# EAGLE schematic A20-Watermelon_Rev_A (EAGLE 4.16), part 1 of 2
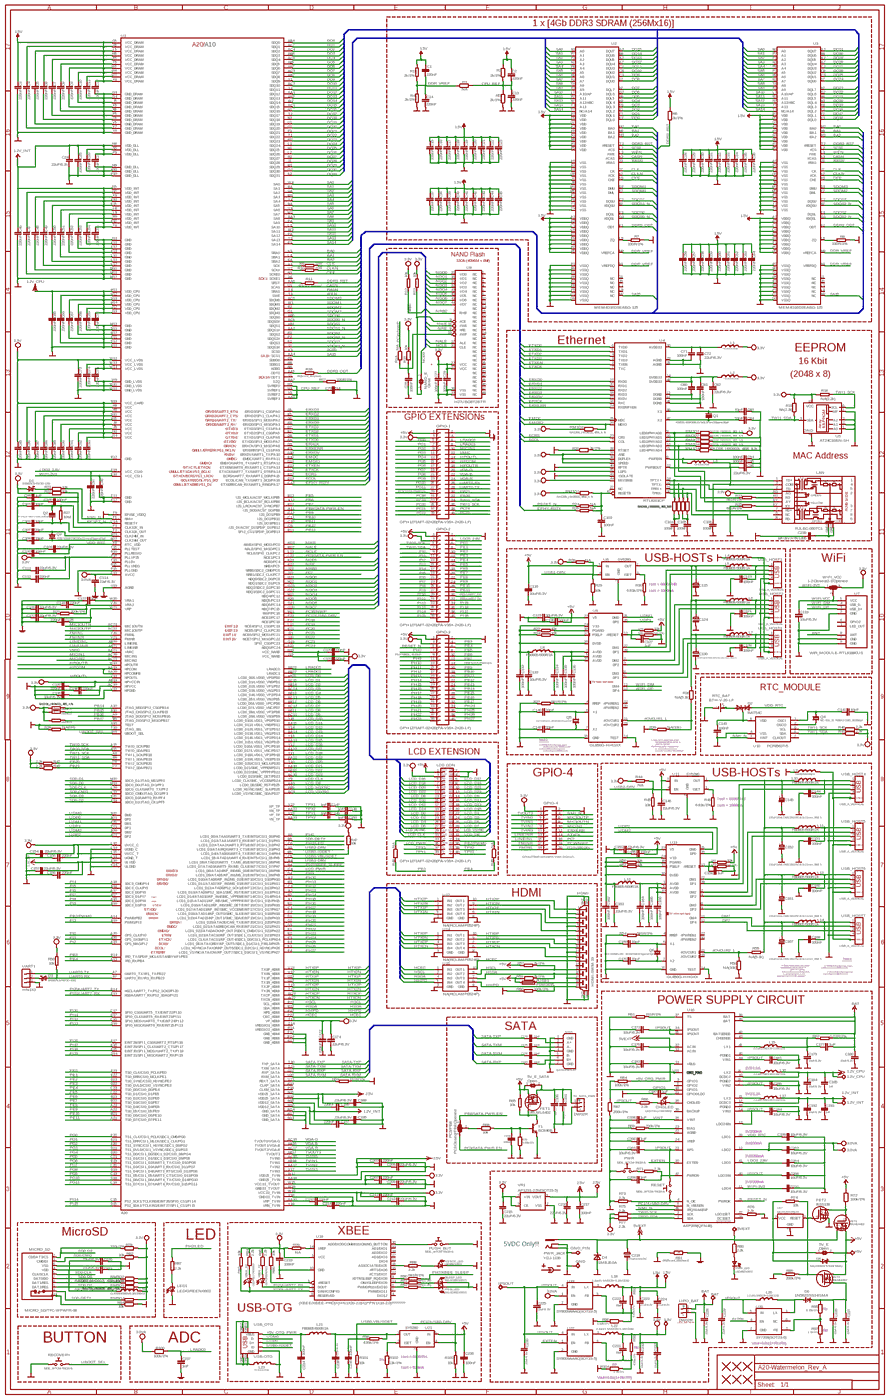
[diagram p0: schematic, sheet 1, overview]
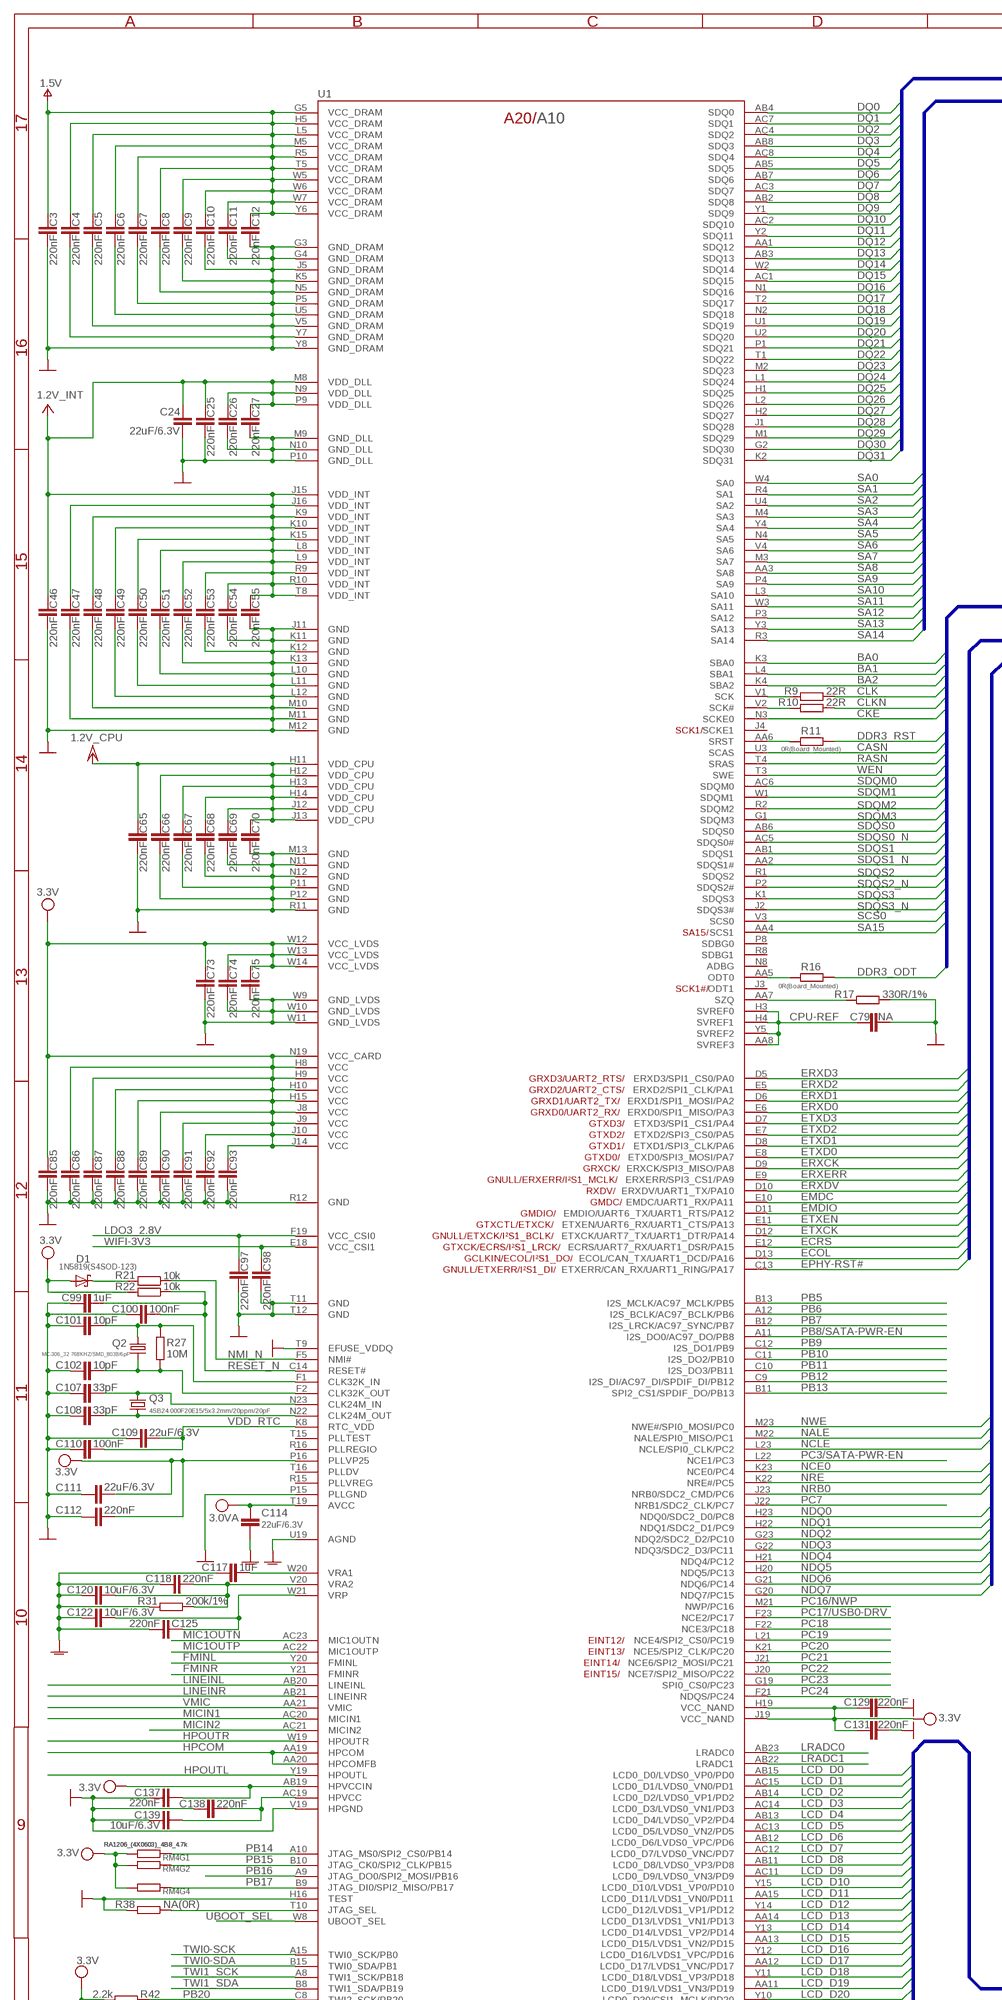
[diagram p1: schematic, sheet 1, part 1 of 4]
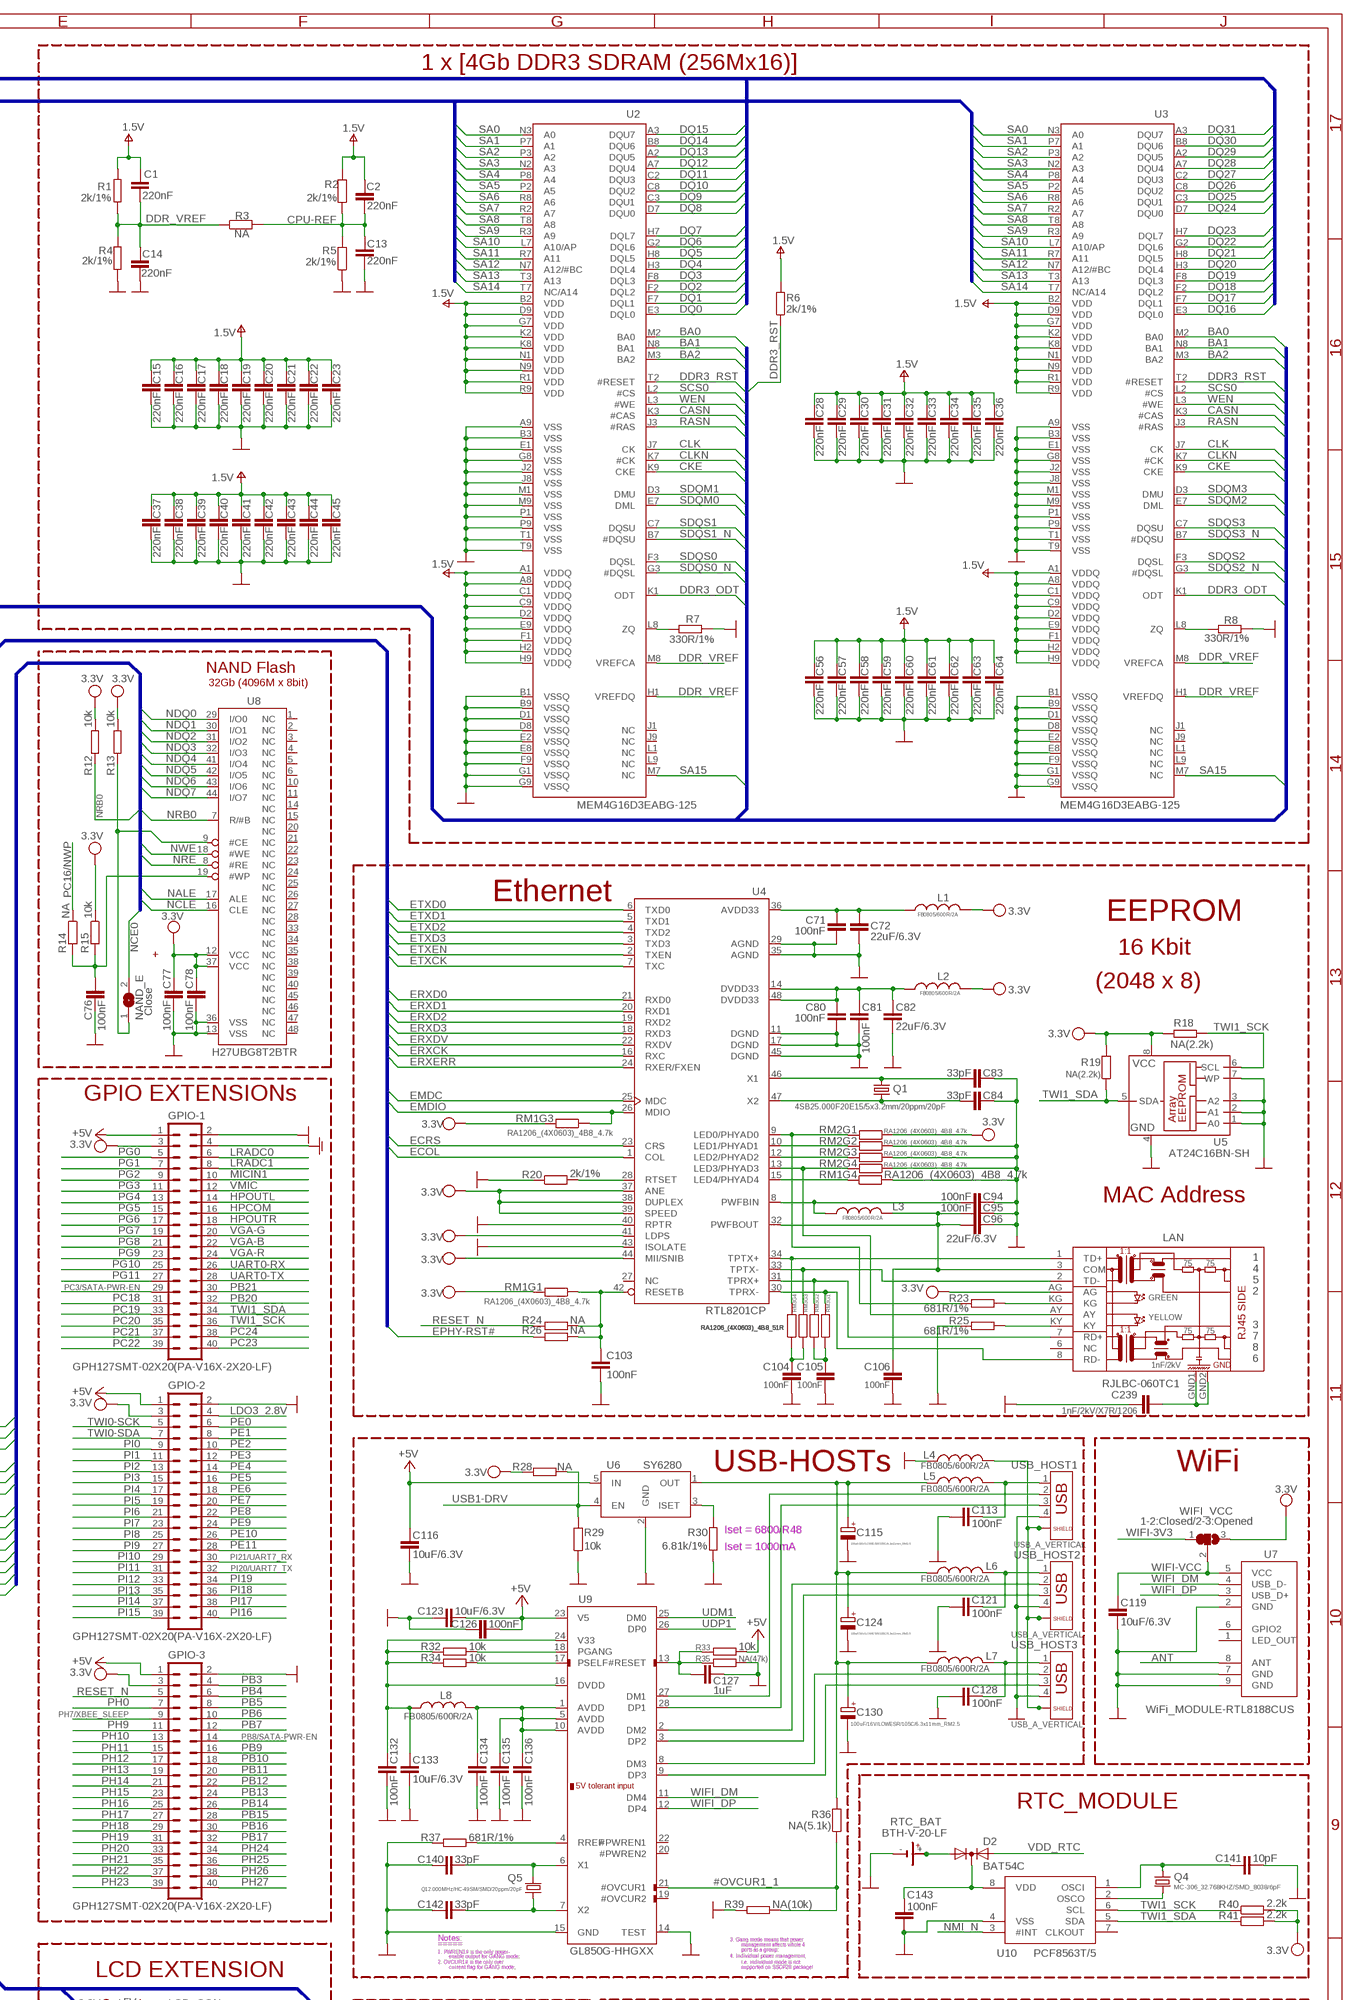
[diagram p2: schematic, sheet 1, part 2 of 4]
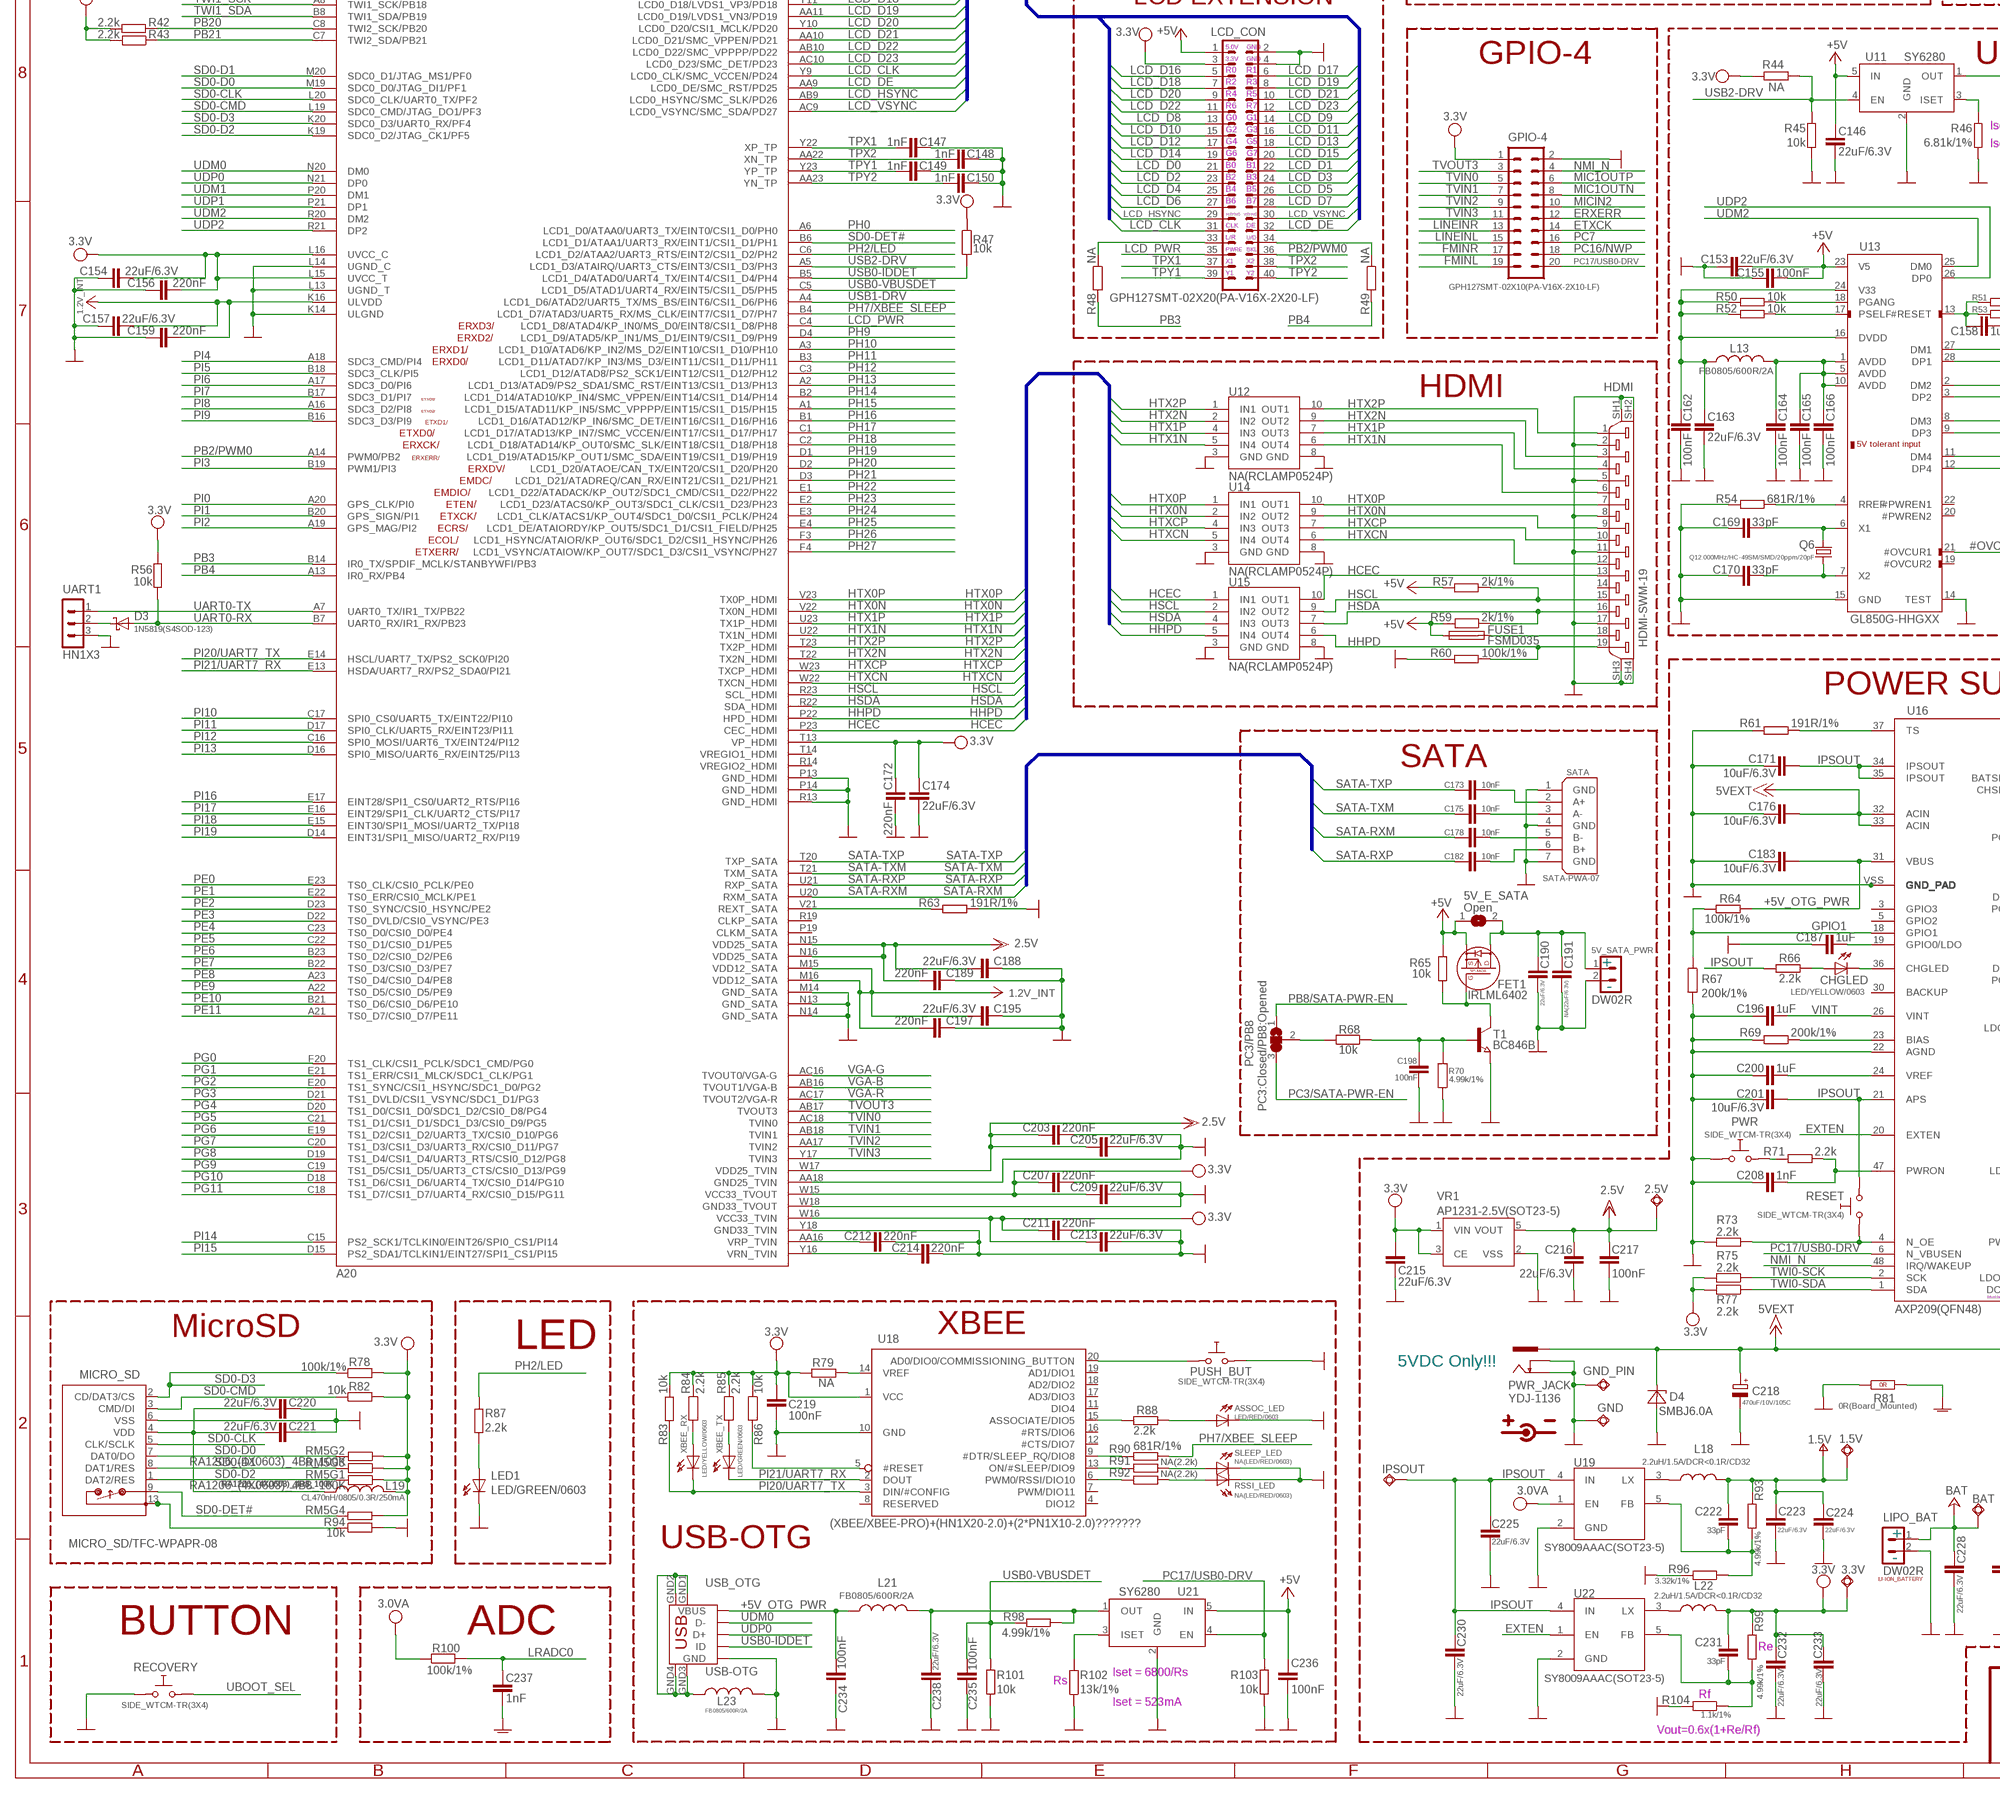
[diagram p3: schematic, sheet 1, part 3 of 4]
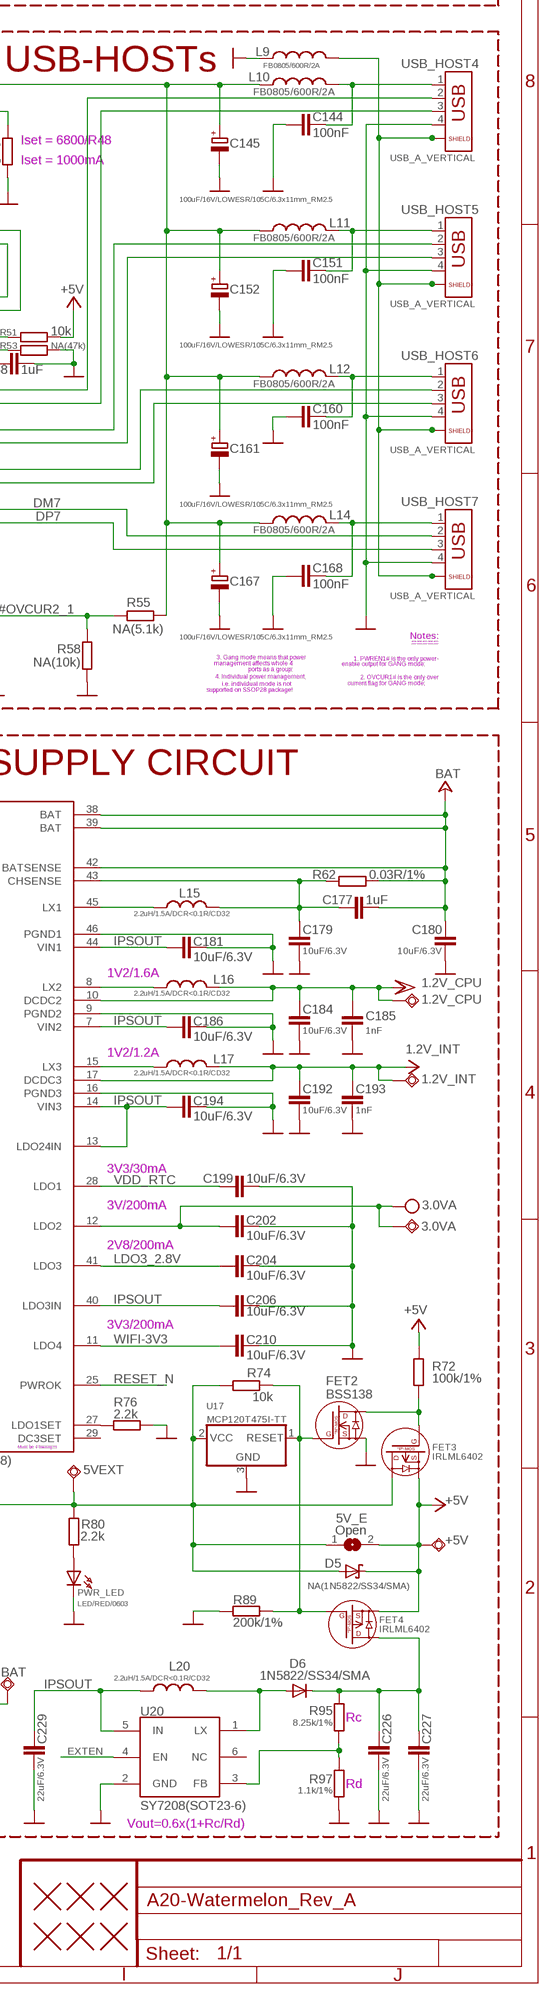
[diagram p4: schematic, sheet 1, part 4 of 4]

## Parts
1.2V_CPU  TESTPADTESTPAD_40-ROUND  [TESTPAD_40-ROUND]
1.2V_INT  TESTPADTESTPAD_40-ROUND  [TESTPAD_40-ROUND]
1.5V  TESTPADTESTPAD_40-ROUND  [TESTPAD_40-ROUND]
2.5V  TESTPADTESTPAD_40-ROUND  [TESTPAD_40-ROUND]
3.0VA  TESTPADTESTPAD_40-ROUND  [TESTPAD_40-ROUND]
3.3V  TESTPADTESTPAD_40-ROUND  [TESTPAD_40-ROUND]
5V_E  Open  SJSJ_SMALLER  [SJ_1_SMALLER]
5V_E_SATA  Open  SJSJ_SMALLER  [SJ_1_SMALLER]
5V_SATA_PWR  DW02R  CON2DW02R  [DW02R]
5VEXT  TESTPADTESTPAD_40-ROUND  [TESTPAD_40-ROUND]
+5V  TESTPADTESTPAD_40-ROUND  [TESTPAD_40-ROUND]
ASSOC_LED  LED/RED/0603  LED0603DWS  [LED-0603]
BAT  TESTPADTESTPAD_40-ROUND  [TESTPAD_40-ROUND]
C1  220nF  C-EUC0402_TI  [C0402_TI]
C2  220nF  C-EUC0402_TI  [C0402_TI]
C3  220nF  C-EUC0402_TI  [C0402_TI]
C4  220nF  C-EUC0402_TI  [C0402_TI]
C5  220nF  C-EUC0402_TI  [C0402_TI]
C6  220nF  C-EUC0402_TI  [C0402_TI]
C7  220nF  C-EUC0402_TI  [C0402_TI]
C8  220nF  C-EUC0402_TI  [C0402_TI]
C9  220nF  C-EUC0402_TI  [C0402_TI]
C10  220nF  C-EUC0402_TI  [C0402_TI]
C11  220nF  C-EUC0402_TI  [C0402_TI]
C12  220nF  C-EUC0402_TI  [C0402_TI]
C13  220nF  C-EUC0402_TI  [C0402_TI]
C14  220nF  C-EUC0402_TI  [C0402_TI]
C15  220nF  C-EUC0402_TI  [C0402_TI]
C16  220nF  C-EUC0402_TI  [C0402_TI]
C17  220nF  C-EUC0402_TI  [C0402_TI]
C18  220nF  C-EUC0402_TI  [C0402_TI]
C19  220nF  C-EUC0402_TI  [C0402_TI]
C20  220nF  C-EUC0402_TI  [C0402_TI]
C21  220nF  C-EUC0402_TI  [C0402_TI]
C22  220nF  C-EUC0402_TI  [C0402_TI]
C23  220nF  C-EUC0402_TI  [C0402_TI]
C24  22uF/6.3V  C-EUC0603_DWS  [C0603_DWS]
C25  220nF  C-EUC0402_TI  [C0402_TI]
C26  220nF  C-EUC0402_TI  [C0402_TI]
C27  220nF  C-EUC0402_TI  [C0402_TI]
C28  220nF  C-EUC0402_TI  [C0402_TI]
C29  220nF  C-EUC0402_TI  [C0402_TI]
C30  220nF  C-EUC0402_TI  [C0402_TI]
C31  220nF  C-EUC0402_TI  [C0402_TI]
C32  220nF  C-EUC0402_TI  [C0402_TI]
C33  220nF  C-EUC0402_TI  [C0402_TI]
C34  220nF  C-EUC0402_TI  [C0402_TI]
C35  220nF  C-EUC0402_TI  [C0402_TI]
C36  220nF  C-EUC0402_TI  [C0402_TI]
C37  220nF  C-EUC0402_TI  [C0402_TI]
C38  220nF  C-EUC0402_TI  [C0402_TI]
C39  220nF  C-EUC0402_TI  [C0402_TI]
C40  220nF  C-EUC0402_TI  [C0402_TI]
C41  220nF  C-EUC0402_TI  [C0402_TI]
C42  220nF  C-EUC0402_TI  [C0402_TI]
C43  220nF  C-EUC0402_TI  [C0402_TI]
C44  220nF  C-EUC0402_TI  [C0402_TI]
C45  220nF  C-EUC0402_TI  [C0402_TI]
C46  220nF  C-EUC0402_TI  [C0402_TI]
C47  220nF  C-EUC0402_TI  [C0402_TI]
C48  220nF  C-EUC0402_TI  [C0402_TI]
C49  220nF  C-EUC0402_TI  [C0402_TI]
C50  220nF  C-EUC0402_TI  [C0402_TI]
C51  220nF  C-EUC0402_TI  [C0402_TI]
C52  220nF  C-EUC0402_TI  [C0402_TI]
C53  220nF  C-EUC0402_TI  [C0402_TI]
C54  220nF  C-EUC0402_TI  [C0402_TI]
C55  220nF  C-EUC0402_TI  [C0402_TI]
C56  220nF  C-EUC0402_TI  [C0402_TI]
C57  220nF  C-EUC0402_TI  [C0402_TI]
C58  220nF  C-EUC0402_TI  [C0402_TI]
C59  220nF  C-EUC0402_TI  [C0402_TI]
C60  220nF  C-EUC0402_TI  [C0402_TI]
C61  220nF  C-EUC0402_TI  [C0402_TI]
C62  220nF  C-EUC0402_TI  [C0402_TI]
C63  220nF  C-EUC0402_TI  [C0402_TI]
C64  220nF  C-EUC0402_TI  [C0402_TI]
C65  220nF  C-EUC0402_TI  [C0402_TI]
C66  220nF  C-EUC0402_TI  [C0402_TI]
C67  220nF  C-EUC0402_TI  [C0402_TI]
C68  220nF  C-EUC0402_TI  [C0402_TI]
C69  220nF  C-EUC0402_TI  [C0402_TI]
C70  220nF  C-EUC0402_TI  [C0402_TI]
C71  100nF  C-EUC0603_MM  [C0603_MM]
C72  22uF/6.3V  C-EUC0603_DWS  [C0603_DWS]
C73  220nF  C-EUC0402_TI  [C0402_TI]
C74  220nF  C-EUC0402_TI  [C0402_TI]
C75  220nF  C-EUC0402_TI  [C0402_TI]
C76  100nF  C-EUC0402_TI  [C0402_TI]
C77  100nF  C-EUC0402_TI  [C0402_TI]
C78  100nF  C-EUC0402_TI  [C0402_TI]
C79  NA  C-EUC0402_TI  [C0402_TI]
C80  100nF  C-EUC0603_MM  [C0603_MM]
C81  100nF  C-EUC0603_MM  [C0603_MM]
C82  22uF/6.3V  C-EUC0603_DWS  [C0603_DWS]
C83  33pF  C-EUC0603_DWS  [C0603_DWS]
C84  33pF  C-EUC0603_DWS  [C0603_DWS]
C85  220nF  C-EUC0402_TI  [C0402_TI]
C86  220nF  C-EUC0402_TI  [C0402_TI]
C87  220nF  C-EUC0402_TI  [C0402_TI]
C88  220nF  C-EUC0402_TI  [C0402_TI]
C89  220nF  C-EUC0402_TI  [C0402_TI]
C90  220nF  C-EUC0402_TI  [C0402_TI]
C91  220nF  C-EUC0402_TI  [C0402_TI]
C92  220nF  C-EUC0402_TI  [C0402_TI]
C93  220nF  C-EUC0402_TI  [C0402_TI]
C94  100nF  C-EUC0603_MM  [C0603_MM]
C95  100nF  C-EUC0603_MM  [C0603_MM]
C96  22uF/6.3V  C-EUC0603_DWS  [C0603_DWS]
C97  220nF  C-EUC0402_TI  [C0402_TI]
C98  220nF  C-EUC0402_TI  [C0402_TI]
C99  1uF  C-EUC0603_DWS  [C0603_DWS]
C100  100nF  C-EUC0402_TI  [C0402_TI]
C101  10pF  C-EUC0402_TI  [C0402_TI]
C102  10pF  C-EUC0402_TI  [C0402_TI]
C103  100nF  C-EUC0603_MM  [C0603_MM]
C104  100nF  C-EUC0603_MM  [C0603_MM]
C105  100nF  C-EUC0603_MM  [C0603_MM]
C106  100nF  C-EUC0603_MM  [C0603_MM]
C107  33pF  C-EUC0603_DWS  [C0603_DWS]
C108  33pF  C-EUC0603_DWS  [C0603_DWS]
C109  22uF/6.3V  C-EUC0603_DWS  [C0603_DWS]
C110  100nF  C-EUC0402_TI  [C0402_TI]
C111  22uF/6.3V  C-EUC0603_DWS  [C0603_DWS]
C112  220nF  C-EUC0402_TI  [C0402_TI]
C113  100nF  C-EUC0603_MM  [C0603_MM]
C114  22uF/6.3V  C-EUC0603_DWS  [C0603_DWS]
C115  100uF/16V/LOWESR/105C/6.3x11mm_RM2.5  CPOL-EUE2.5-6.3  [E2,5-6,3]
C116  10uF/6.3V  C-EUC0603_DWS  [C0603_DWS]
C117  1uF  C-EUC0603_DWS  [C0603_DWS]
C118  220nF  C-EUC0402_TI  [C0402_TI]
C119  10uF/6.3V  C-EUC0603_DWS  [C0603_DWS]
C120  10uF/6.3V  C-EUC0603_DWS  [C0603_DWS]
C121  100nF  C-EUC0603_MM  [C0603_MM]
C122  10uF/6.3V  C-EUC0603_DWS  [C0603_DWS]
C123  10uF/6.3V  C-EUC0603_DWS  [C0603_DWS]
C124  100uF/16V/LOWESR/105C/6.3x11mm_RM2.5  CPOL-EUE2.5-6.3  [E2,5-6,3]
C125  220nF  C-EUC0402_TI  [C0402_TI]
C126  100nF  C-EUC0603_MM  [C0603_MM]
C127  1uF  C-EUC0603_DWS  [C0603_DWS]
C128  100nF  C-EUC0603_MM  [C0603_MM]
C129  220nF  C-EUC0402_TI  [C0402_TI]
C130  100uF/16V/LOWESR/105C/6.3x11mm_RM2.5  CPOL-EUE2.5-6.3  [E2,5-6,3]
C131  220nF  C-EUC0402_TI  [C0402_TI]
C132  100nF  C-EUC0603_MM  [C0603_MM]
C133  10uF/6.3V  C-EUC0603_DWS  [C0603_DWS]
C134  100nF  C-EUC0603_MM  [C0603_MM]
C135  100nF  C-EUC0603_MM  [C0603_MM]
C136  100nF  C-EUC0603_MM  [C0603_MM]
C137  220nF  C-EUC0402_TI  [C0402_TI]
C138  220nF  C-EUC0402_TI  [C0402_TI]
C139  10uF/6.3V  C-EUC0603_DWS  [C0603_DWS]
C140  33pF  C-EUC0603_DWS  [C0603_DWS]
C141  10pF  C-EUC0402_TI  [C0402_TI]
C142  33pF  C-EUC0603_DWS  [C0603_DWS]
C143  100nF  C-EUC0603_MM  [C0603_MM]
C144  100nF  C-EUC0603_MM  [C0603_MM]
C145  100uF/16V/LOWESR/105C/6.3x11mm_RM2.5  CPOL-EUE2.5-6.3  [E2,5-6,3]
C146  22uF/6.3V  C-EUC0603_DWS  [C0603_DWS]
C147  1nF  C-EUC0402_TI  [C0402_TI]
C148  1nF  C-EUC0402_TI  [C0402_TI]
C149  1nF  C-EUC0402_TI  [C0402_TI]
C150  1nF  C-EUC0402_TI  [C0402_TI]
C151  100nF  C-EUC0603_MM  [C0603_MM]
C152  100uF/16V/LOWESR/105C/6.3x11mm_RM2.5  CPOL-EUE2.5-6.3  [E2,5-6,3]
C153  22uF/6.3V  C-EUC0603_DWS  [C0603_DWS]
C154  22uF/6.3V  C-EUC0603_DWS  [C0603_DWS]
C155  100nF  C-EUC0603_MM  [C0603_MM]
C156  220nF  C-EUC0402_TI  [C0402_TI]
C157  22uF/6.3V  C-EUC0603_DWS  [C0603_DWS]
C158  1uF  C-EUC0603_DWS  [C0603_DWS]
C159  220nF  C-EUC0402_TI  [C0402_TI]
C160  100nF  C-EUC0603_MM  [C0603_MM]
C161  100uF/16V/LOWESR/105C/6.3x11mm_RM2.5  CPOL-EUE2.5-6.3  [E2,5-6,3]
C162  100nF  C-EUC0603_MM  [C0603_MM]
C163  22uF/6.3V  C-EUC0603_DWS  [C0603_DWS]
C164  100nF  C-EUC0603_MM  [C0603_MM]
C165  100nF  C-EUC0603_MM  [C0603_MM]
C166  100nF  C-EUC0603_MM  [C0603_MM]
C167  100uF/16V/LOWESR/105C/6.3x11mm_RM2.5  CPOL-EUE2.5-6.3  [E2,5-6,3]
C168  100nF  C-EUC0603_MM  [C0603_MM]
C169  33pF  C-EUC0603_DWS  [C0603_DWS]
C170  33pF  C-EUC0603_DWS  [C0603_DWS]
C171  10uF/6.3V  C-EUC0603_DWS  [C0603_DWS]
C172  220nF  C-EUC0402_TI  [C0402_TI]
C173  10nF  C-EUC0402_TI  [C0402_TI]
C174  22uF/6.3V  C-EUC0603_DWS  [C0603_DWS]
C175  10nF  C-EUC0402_TI  [C0402_TI]
C176  10uF/6.3V  C-EUC0603_DWS  [C0603_DWS]
C177  1uF  C-EUC0603_DWS  [C0603_DWS]
C178  10nF  C-EUC0402_TI  [C0402_TI]
C179  10uF/6.3V  C-EUC0603_DWS  [C0603_DWS]
C180  10uF/6.3V  C-EUC0603_DWS  [C0603_DWS]
C181  10uF/6.3V  C-EUC0603_DWS  [C0603_DWS]
C182  10nF  C-EUC0402_TI  [C0402_TI]
C183  10uF/6.3V  C-EUC0603_DWS  [C0603_DWS]
C184  10uF/6.3V  C-EUC0603_DWS  [C0603_DWS]
C185  1nF  C-EUC0402_TI  [C0402_TI]
C186  10uF/6.3V  C-EUC0603_DWS  [C0603_DWS]
C187  1uF  C-EUC0603_DWS  [C0603_DWS]
C188  22uF/6.3V  C-EUC0603_DWS  [C0603_DWS]
C189  220nF  C-EUC0402_TI  [C0402_TI]
C190  22uF/6.3V  C-EUC0603_DWS  [C0603_DWS]
C191  NA(22uF/6.3V)  C-EUC0603_DWS  [C0603_DWS]
C192  10uF/6.3V  C-EUC0603_DWS  [C0603_DWS]
C193  1nF  C-EUC0402_TI  [C0402_TI]
C194  10uF/6.3V  C-EUC0603_DWS  [C0603_DWS]
C195  22uF/6.3V  C-EUC0603_DWS  [C0603_DWS]
C196  1uF  C-EUC0603_DWS  [C0603_DWS]
C197  220nF  C-EUC0402_TI  [C0402_TI]
C198  100nF  C-EUC0402_TI  [C0402_TI]
C199  10uF/6.3V  C-EUC0603_DWS  [C0603_DWS]
C200  1uF  C-EUC0603_DWS  [C0603_DWS]
C201  10uF/6.3V  C-EUC0603_DWS  [C0603_DWS]
C202  10uF/6.3V  C-EUC0603_DWS  [C0603_DWS]
C203  220nF  C-EUC0402_TI  [C0402_TI]
C204  10uF/6.3V  C-EUC0603_DWS  [C0603_DWS]
C205  22uF/6.3V  C-EUC0603_DWS  [C0603_DWS]
C206  10uF/6.3V  C-EUC0603_DWS  [C0603_DWS]
C207  220nF  C-EUC0402_TI  [C0402_TI]
C208  1nF  C-EUC0402_TI  [C0402_TI]
C209  22uF/6.3V  C-EUC0603_DWS  [C0603_DWS]
C210  10uF/6.3V  C-EUC0603_DWS  [C0603_DWS]
C211  220nF  C-EUC0402_TI  [C0402_TI]
C212  220nF  C-EUC0402_TI  [C0402_TI]
C213  22uF/6.3V  C-EUC0603_DWS  [C0603_DWS]
C214  220nF  C-EUC0402_TI  [C0402_TI]
C215  22uF/6.3V  C-EUC0603_DWS  [C0603_DWS]
C216  22uF/6.3V  C-EUC0603_DWS  [C0603_DWS]
C217  100nF  C-EUC0402_TI  [C0402_TI]
C218  470uF/10V/105C  CPOL-EUE2.5-6.3  [E2,5-6,3]
C219  100nF  C-EUC0603_MM  [C0603_MM]
C220  22uF/6.3V  C-EUC0603_DWS  [C0603_DWS]
C221  22uF/6.3V  C-EUC0603_DWS  [C0603_DWS]
C222  33pF  C-EUC0603_DWS  [C0603_DWS]
C223  22uF/6.3V  C-EUC0603_DWS  [C0603_DWS]
C224  22uF/6.3V  C-EUC0603_DWS  [C0603_DWS]
C225  22uF/6.3V  C-EUC0603_DWS  [C0603_DWS]
C226  22uF/6.3V  C-EUC0603_DWS  [C0603_DWS]
C227  22uF/6.3V  C-EUC0603_DWS  [C0603_DWS]
C228  22uF/6.3V  C-EUC0603_DWS  [C0603_DWS]
C229  22uF/6.3V  C-EUC0603_DWS  [C0603_DWS]
C230  22uF/6.3V  C-EUC0603_DWS  [C0603_DWS]
C231  33pF  C-EUC0603_DWS  [C0603_DWS]
C232  22uF/6.3V  C-EUC0603_DWS  [C0603_DWS]
C233  22uF/6.3V  C-EUC0603_DWS  [C0603_DWS]
C234  100nF  C-EUC0402_TI  [C0402_TI]
C235  100nF  C-EUC0402_TI  [C0402_TI]
C236  100nF  C-EUC0402_TI  [C0402_TI]
C237  1nF  C-EUC0402_TI  [C0402_TI]
C238  22uF/6.3V  C-EUC0603_DWS  [C0603_DWS]
C239  1nF/2kV/X7R/1206  C-EUC1206_5MILS_WS_ISO  [C1206_5MILS_WS_ISO]
CHGLED  LED/YELLOW/0603  LED0603DWS  [LED-0603]
D1  1N5819(S4SOD-123)  SCHOTKKY7.62SS-1N5819(S4SOD-123)  [SOD-123]
D2  BAT54C  DIODE_AC-CA_  [SOT23C]
D3  1N5819(S4SOD-123)  SCHOTKKY7.62SS-1N5819(S4SOD-123)  [SOD-123]
D4  SMBJ6.0A  SMBJ16A  [DO214AA]
D5  NA(1N5822/SS34/SMA)  SCHOTKKY7.62SS2  [MLL-41]
D6  1N5822/SS34/SMA  D-MLL-41  [MELF-MLL41]
FET1  IRLML6402  P-MOS+DIODIRLML6402  [SOT23]
FET2  BSS138  N-MOS+DIODBSS138(SOT23-3)  [SOT23]
FET3  IRLML6402  P-MOS+DIODIRLML6402  [SOT23]
FET4  IRLML6402  P-MOS+DIODIRLML6402  [SOT23]
FUSE1  FSMD035  FUSE  [1206]
GND  TESTPADTESTPAD_40-ROUND  [TESTPAD_40-ROUND]
GND_PIN  TESTPAD3  [TEST_PAD40/70/SQUARE]
GPIO-1  GPH127SMT-02X20(PA-V16X-2X20-LF)  ML40-GPH127SMT-02X20(PA-V16X-2X20-LF)  [GPH127SMT-02X20(PA-V16X-2X20-LF)]
GPIO-2  GPH127SMT-02X20(PA-V16X-2X20-LF)  ML40-GPH127SMT-02X20(PA-V16X-2X20-LF)  [GPH127SMT-02X20(PA-V16X-2X20-LF)]
GPIO-3  GPH127SMT-02X20(PA-V16X-2X20-LF)  ML40-GPH127SMT-02X20(PA-V16X-2X20-LF)  [GPH127SMT-02X20(PA-V16X-2X20-LF)]
GPIO-4  GPH127SMT-02X10(PA-V16X-2X10-LF)  ML20GPH127SMT-02X10(PA-V16X-2X10-LF)  [GPH127SMT-02X10(PA-V16X-2X10-LF)]
HDMI  HDMI-SWM-19  HDMI-MC34931HDMI-SWM-19  [HDMI-SWM-19]
IPSOUT  TESTPADTESTPAD_40-ROUND  [TESTPAD_40-ROUND]
L1  FB0805/600R/2A  L-USL0805_5MIL_DWS  [L0805_5MIL_DWS]
L2  FB0805/600R/2A  L-USL0805_5MIL_DWS  [L0805_5MIL_DWS]
L3  FB0805/600R/2A  L-USL0805_5MIL_DWS  [L0805_5MIL_DWS]
L4  FB0805/600R/2A  L-USL0805_5MIL_DWS  [L0805_5MIL_DWS]
L5  FB0805/600R/2A  L-USL0805_5MIL_DWS  [L0805_5MIL_DWS]
L6  FB0805/600R/2A  L-USL0805_5MIL_DWS  [L0805_5MIL_DWS]
L7  FB0805/600R/2A  L-USL0805_5MIL_DWS  [L0805_5MIL_DWS]
L8  FB0805/600R/2A  L-USL0805_5MIL_DWS  [L0805_5MIL_DWS]
L9  FB0805/600R/2A  L-USL0805_5MIL_DWS  [L0805_5MIL_DWS]
L10  FB0805/600R/2A  L-USL0805_5MIL_DWS  [L0805_5MIL_DWS]
L11  FB0805/600R/2A  L-USL0805_5MIL_DWS  [L0805_5MIL_DWS]
L12  FB0805/600R/2A  L-USL0805_5MIL_DWS  [L0805_5MIL_DWS]
L13  FB0805/600R/2A  L-USL0805_5MIL_DWS  [L0805_5MIL_DWS]
L14  FB0805/600R/2A  L-USL0805_5MIL_DWS  [L0805_5MIL_DWS]
L15  2.2uH/1.5A/DCR<0.1R/CD32  L-CD32  [CD32]
L16  2.2uH/1.5A/DCR<0.1R/CD32  L-CD32  [CD32]
L17  2.2uH/1.5A/DCR<0.1R/CD32  L-CD32  [CD32]
L18  2.2uH/1.5A/DCR<0.1R/CD32  L-CD32  [CD32]
L19  CL470nH/0805/0.3R/250mA  L-USL0805_5MIL_DWS  [L0805_5MIL_DWS]
L20  2.2uH/1.5A/DCR<0.1R/CD32  L-CD32  [CD32]
L21  FB0805/600R/2A  L-USL0805_5MIL_DWS  [L0805_5MIL_DWS]
L22  2.2uH/1.5A/DCR<0.1R/CD32  L-CD32  [CD32]
L23  FB0805/600R/2A  L-USL0805_5MIL_DWS  [L0805_5MIL_DWS]
LAN  RJLBC-060TC1  RJLBC-060TC1_GND_MILLING  [RJLBC-060TC1_MILLING]
LCD_CON  GPH127SMT-02X20(PA-V16X-2X20-LF)  ML40-GPH127SMT-02X20(PA-V16X-2X20-LF)  [GPH127SMT-02X20(PA-V16X-2X20-LF)]
LED1  LED/GREEN/0603  LED0603DWS  [LED-0603]
LIPO_BAT  DW02R  CON2DW02R  [DW02R]
MICRO_SD  MICRO_SD/TFC-WPAPR-08  MICRO_SD/MMC_CP_NEWTFC-WPAPR-08  [TFC-WPAPR-08]
NAND_E  Close  SJSJ_1_SMALLER_CLOSE_10MILS  [SJ_1_SMALLER_CLOSE_10MILS]
PC3/PB8  PC3:Closed/PB8:Opened  SJ2W5  [SJ_2_SMALL_23_TIED]
PUSH_BUT  SIDE_WTCM-TR(3X4)  SW-TAKTSIDE_WTCM-TR(3X4)  [SW_TAKT3X4]
PWR  SIDE_WTCM-TR(3X4)  SW-TAKTSIDE_WTCM-TR(3X4)  [SW_TAKT3X4]
PWR_JACK  YDJ-1136  PWR-JAKPWR_JACK_UNI_MILLING  [PWR_JACK_UNI_MILLING]
PWR_LED  LED/RED/0603  LED0603DWS  [LED-0603]
Q1  4SB25.000F20E15/5x3.2mm/20ppm/20pF  HC49/S_E4SB25.000F20E15  [HCX-4S]
Q2  MC-306_32.768KHZ/SMD_8038/6pF  MC-306_32.768KHZ/SMD_8038  [MC-306]
Q3  4SB24.000F20E15/5x3.2mm/20ppm/20pF  HC49/S_E4SB25.000F20E15  [HCX-4S]
Q4  MC-306_32.768KHZ/SMD_8038/6pF  MC-306_32.768KHZ/SMD_8038  [MC-306]
Q5  Q12.000MHz/HC-49SM/SMD/20ppm/20pF  HC49/SHC49/SMD_THIN&SHORT  [HC49/SMD2_THIN&SHORT]
Q6  Q12.000MHz/HC-49SM/SMD/20ppm/20pF  HC49/SHC49/SMD_THIN&SHORT  [HC49/SMD2_THIN&SHORT]
R1  2k/1%  R-EU_R0402_TI  [R0402_TI]
R2  2k/1%  R-EU_R0402_TI  [R0402_TI]
R3  NA  R-EU_R0402_TI  [R0402_TI]
R4  2k/1%  R-EU_R0402_TI  [R0402_TI]
R5  2k/1%  R-EU_R0402_TI  [R0402_TI]
R6  2k/1%  R-EU_R0402_TI  [R0402_TI]
R7  330R/1%  R-EU_R0603_5MIL_DWS  [R0603_5MIL_DWS]
R8  330R/1%  R-EU_R0603_5MIL_DWS  [R0603_5MIL_DWS]
R9  22R  R-EU_R0402_TI  [R0402_TI]
R10  22R  R-EU_R0402_TI  [R0402_TI]
R11  0R(Board_Mounted)  R-EU_R0402_TI_0R  [R0402_TI_0R]
R12  10k  R-EU_R0402_TI  [R0402_TI]
R13  10k  R-EU_R0402_TI  [R0402_TI]
R14  NA  R-EU_R0402_TI  [R0402_TI]
R15  10k  R-EU_R0402_TI  [R0402_TI]
R16  0R(Board_Mounted)  R-EU_R0402_TI_0R  [R0402_TI_0R]
R17  330R/1%  R-EU_R0603_5MIL_DWS  [R0603_5MIL_DWS]
R18  NA(2.2k)  R-EU_R0402_TI  [R0402_TI]
R19  NA(2.2k)  R-EU_R0402_TI  [R0402_TI]
R20  2k/1%  R-EU_R0402_TI  [R0402_TI]
R21  10k  R-EU_R0402_TI  [R0402_TI]
R22  10k  R-EU_R0402_TI  [R0402_TI]
R23  681R/1%  R-EU_R0603_5MIL_DWS  [R0603_5MIL_DWS]
R24  NA  R-EU_R0603_5MIL_DWS  [R0603_5MIL_DWS]
R25  681R/1%  R-EU_R0603_5MIL_DWS  [R0603_5MIL_DWS]
R26  NA  R-EU_R0603_5MIL_DWS  [R0603_5MIL_DWS]
R27  10M  R-EU_R0402_TI  [R0402_TI]
R28  NA  R-EU_R0603_5MIL_DWS  [R0603_5MIL_DWS]
R29  10k  R-EU_R0603MM  [R0603MM]
R30  6.81k/1%  R-EU_R0603_5MIL_DWS  [R0603_5MIL_DWS]
R31  200k/1%  R-EU_R0603_5MIL_DWS  [R0603_5MIL_DWS]
R32  10k  R-EU_R0603MM  [R0603MM]
R33  10k  R-EU_R0603MM  [R0603MM]
R34  10k  R-EU_R0603MM  [R0603MM]
R35  NA(47k)  R-EU_R0603_5MIL_DWS  [R0603_5MIL_DWS]
R36  NA(5.1k)  R-EU_R0603_5MIL_DWS  [R0603_5MIL_DWS]
R37  681R/1%  R-EU_R0603_5MIL_DWS  [R0603_5MIL_DWS]
R38  NA(0R)  R-EU_R0603_5MIL_DWS  [R0603_5MIL_DWS]
R39  NA(10k)  R-EU_R0603_5MIL_DWS  [R0603_5MIL_DWS]
R40  2.2k  R-EU_R0603MM  [R0603MM]
R41  2.2k  R-EU_R0603MM  [R0603MM]
R42  2.2k  R-EU_R0402_TI  [R0402_TI]
R43  2.2k  R-EU_R0402_TI  [R0402_TI]
R44  NA  R-EU_R0603_5MIL_DWS  [R0603_5MIL_DWS]
R45  10k  R-EU_R0603MM  [R0603MM]
R46  6.81k/1%  R-EU_R0603_5MIL_DWS  [R0603_5MIL_DWS]
R47  10k  R-EU_R0402_TI  [R0402_TI]
R48  NA  R-EU_R0603_5MIL_DWS  [R0603_5MIL_DWS]
R49  NA  R-EU_R0603_5MIL_DWS  [R0603_5MIL_DWS]
R50  10k  R-EU_R0603MM  [R0603MM]
R51  10k  R-EU_R0603MM  [R0603MM]
R52  10k  R-EU_R0603MM  [R0603MM]
R53  NA(47k)  R-EU_R0603_5MIL_DWS  [R0603_5MIL_DWS]
R54  681R/1%  R-EU_R0603_5MIL_DWS  [R0603_5MIL_DWS]
R55  NA(5.1k)  R-EU_R0603_5MIL_DWS  [R0603_5MIL_DWS]
R56  10k  R-EU_R0402_TI  [R0402_TI]
R57  2k/1%  R-EU_R0402_TI  [R0402_TI]
R58  NA(10k)  R-EU_R0603_5MIL_DWS  [R0603_5MIL_DWS]
R59  2k/1%  R-EU_R0402_TI  [R0402_TI]
R60  100k/1%  R-EU_R0603_5MIL_DWS  [R0603_5MIL_DWS]
R61  191R/1%  R-EU_R0603_5MIL_DWS  [R0603_5MIL_DWS]
R62  0.03R/1%  R-EU_R1206_5MIL_WS  [R1206_5MIL_WS]
R63  191R/1%  R-EU_R0603_5MIL_DWS  [R0603_5MIL_DWS]
R64  100k/1%  R-EU_R0603_5MIL_DWS  [R0603_5MIL_DWS]
R65  10k  R-EU_R0402_TI  [R0402_TI]
R66  2.2k  R-EU_R0603MM  [R0603MM]
R67  200k/1%  R-EU_R0603_5MIL_DWS  [R0603_5MIL_DWS]
R68  10k  R-EU_R0402_TI  [R0402_TI]
R69  200k/1%  R-EU_R0603_5MIL_DWS  [R0603_5MIL_DWS]
R70  4.99k/1%  R-EU_R0603_5MIL_DWS  [R0603_5MIL_DWS]
R71  2.2k  R-EU_R0402_TI  [R0402_TI]
R72  100k/1%  R-EU_R0603_5MIL_DWS  [R0603_5MIL_DWS]
R73  2.2k  R-EU_R0402_TI  [R0402_TI]
R74  10k  R-EU_R0603MM  [R0603MM]
R75  2.2k  R-EU_R0402_TI  [R0402_TI]
R76  2.2k  R-EU_R0402_TI  [R0402_TI]
R77  2.2k  R-EU_R0402_TI  [R0402_TI]
R78  100k/1%  R-EU_R0603_5MIL_DWS  [R0603_5MIL_DWS]
R79  NA  R-EU_R0603_5MIL_DWS  [R0603_5MIL_DWS]
R80  2.2k  R-EU_R0603MM  [R0603MM]
R81  0R(Board_Mounted)  R_0R0R(NA)  [0603_0R]
R82  10k  R-EU_R0402_TI  [R0402_TI]
R83  10k  R-EU_R0603MM  [R0603MM]
R84  2.2k  R-EU_R0603MM  [R0603MM]
R85  2.2k  R-EU_R0603MM  [R0603MM]
R86  10k  R-EU_R0603MM  [R0603MM]
R87  2.2k  R-EU_R0402_TI  [R0402_TI]
R88  2.2k  R-EU_R0603MM  [R0603MM]
R89  200k/1%  R-EU_R0603_5MIL_DWS  [R0603_5MIL_DWS]
R90  681R/1%  R-EU_R0603_5MIL_DWS  [R0603_5MIL_DWS]
R91  NA(2.2k)  R-EU_R0603_5MIL_DWS  [R0603_5MIL_DWS]
R92  NA(2.2k)  R-EU_R0603_5MIL_DWS  [R0603_5MIL_DWS]
R93  4.99k/1%  R-EU_R0603_5MIL_DWS  [R0603_5MIL_DWS]
R94  10k  R-EU_R0402_TI  [R0402_TI]
R95  8.25k/1%  R-EU_R0603_5MIL_DWS  [R0603_5MIL_DWS]
R96  3.32k/1%  R-EU_R0603_5MIL_DWS  [R0603_5MIL_DWS]
R97  1.1k/1%  R-EU_R0603_5MIL_DWS  [R0603_5MIL_DWS]
R98  4.99k/1%  R-EU_R0603_5MIL_DWS  [R0603_5MIL_DWS]
R99  4.99k/1%  R-EU_R0603_5MIL_DWS  [R0603_5MIL_DWS]
R100  100k/1%  R-EU_R0603_5MIL_DWS  [R0603_5MIL_DWS]
R101  10k  R-EU_R0402_TI  [R0402_TI]
R102  13k/1%  R-EU_R0603_5MIL_DWS  [R0603_5MIL_DWS]
R103  10k  R-EU_R0402_TI  [R0402_TI]
R104  1.1k/1%  R-EU_R0603_5MIL_DWS  [R0603_5MIL_DWS]
RECOVERY  SIDE_WTCM-TR(3X4)  SW-TAKTSIDE_WTCM-TR(3X4)  [SW_TAKT3X4]
RESET  SIDE_WTCM-TR(3X4)  SW-TAKTSIDE_WTCM-TR(3X4)  [SW_TAKT3X4]
RM1  RA1206_(4X0603)_4B8_4.7k  R_MATRIX_4E  [R_MATRIX_4]
RM2  RA1206_(4X0603)_4B8_4.7k  R_MATRIX_4E  [R_MATRIX_4]
RM3  RA1206_(4X0603)_4B8_51R  R_MATRIX_4E  [R_MATRIX_4]
RM4  RA1206_(4X0603)_4B8_4.7k  R_MATRIX_4E  [R_MATRIX_4]
RM5  RA1206_(4X0603)_4B8_100K  R_MATRIX_4E  [R_MATRIX_4]
RSSI_LED  NA(LED/RED/0603)  LED0603DWS  [LED-0603]
RTC_BAT  BTH-V-20-LF  B1  [3V_BAT_HOLDER]
SATA  SATA-PWA-07  [SATA-PWA-07]
SLEEP_LED  NA(LED/RED/0603)  LED0603DWS  [LED-0603]
T1  BC846B  NPN-TRANSISTOR_SOT23  [SOT23]
U1  A20  A10  [TFBGA441]
U2  MEM4G16D3EABG-125  H5TQ2G63BFR_MEM4G16D3EABG-125PHIS  [FBGA96_MEM]
U3  MEM4G16D3EABG-125  H5TQ2G63BFR_MEM4G16D3EABG-125PHIS  [FBGA96_MEM]
U4  RTL8201CP  [LQFP48]
U5  AT24C16BN-SH  24LCXX  [SO-08MN]
U6  SY6280  [SOT23-5]
U7  WiFi_MODULE-RTL8188CUS  WM294_WIFI_802_11_N  [PCB_WIFI]
U8  H27UBG8T2BTR  H27UBG8T2A  [TSOP48]
U9  GL850G-HHGXX  GL850G  [SSOP28]
U10  PCF8563T/5  PCF8563  [SO-8]
U11  SY6280  [SOT23-5]
U12  NA(RCLAMP0524P)  RCLAMP0524P  [SLP2510P8]
U13  GL850G-HHGXX  GL850G  [SSOP28]
U14  NA(RCLAMP0524P)  RCLAMP0524P  [SLP2510P8]
U15  NA(RCLAMP0524P)  RCLAMP0524P  [SLP2510P8]
U16  AXP209(QFN48)  AXP209  [QFN48]
U17  MCP120T475I-TT  RESETMCP130T-300-I/TT  [SOT23]
U18  (XBEE/XBEE-PRO)+(HN1X20-2.0)+(2*PN1X10-2.0)???????  XBEE&XBEE-PRO  [XBEE&XBEE-PRO_RPSMA]
U19  SY8009AAAC(SOT23-5)  SY8008  [SOT23-5]
U20  SY7208(SOT23-6)  SY7208  [SOT23-6]
U21  SY6280  [SOT23-5]
U22  SY8009AAAC(SOT23-5)  SY8008  [SOT23-5]
U23  FIDUCIAL  [FIDUCIAL-1X3]
U24  FIDUCIAL  [FIDUCIAL-1X3]
U25  FIDUCIAL  [FIDUCIAL-1X3]
U26  FIDUCIAL  [FIDUCIAL-1X3]
U27  FIDUCIAL  [FIDUCIAL-1X3]
U28  FIDUCIAL  [FIDUCIAL-1X3]
UART1  HN1X3  CON3HN1X3  [HN1X3]
USB_HOST1  USB_A_VERTICAL  USB_SHIELDUSB_A_VERTICAL  [USB_A_VERTICAL_PTH]
USB_HOST2  USB_A_VERTICAL  USB_SHIELDUSB_A_VERTICAL  [USB_A_VERTICAL_PTH]
USB_HOST3  USB_A_VERTICAL  USB_SHIELDUSB_A_VERTICAL  [USB_A_VERTICAL_PTH]
USB_HOST4  USB_A_VERTICAL  USB_SHIELDUSB_A_VERTICAL  [USB_A_VERTICAL_PTH]
USB_HOST5  USB_A_VERTICAL  USB_SHIELDUSB_A_VERTICAL  [USB_A_VERTICAL_PTH]
USB_HOST6  USB_A_VERTICAL  USB_SHIELDUSB_A_VERTICAL  [USB_A_VERTICAL_PTH]
USB_HOST7  USB_A_VERTICAL  USB_SHIELDUSB_A_VERTICAL  [USB_A_VERTICAL_PTH]
USB_OTG  USB-OTG  MINI_USB9  [USB_MINI_9PIN]
VR1  AP1231-2.5V(SOT23-5)  AP1231-33  [SOT-23-5]
WIFI_VCC  1-2:Closed/2-3:Opened  SJ2W6  [SJ_2_SMALL_12_TIED]
XBEE_RX  LED/YELLOW/0603  LED0603DWS  [LED-0603]
XBEE_TX  LED/GREEN/0603  LED0603DWS  [LED-0603]